# EAGLE schematic 090559_Sceptre (EAGLE 5.10)
AUTHOR: Elektor/CPV; DATASHEET: http://uk.farnell.com/multicomp/sdbmf-00915b0t2/card-sd-push-push/dp/9186174?Ntt=9186174; NRS: 090559-I; REV: 1.2

## Sheet 1 of 7
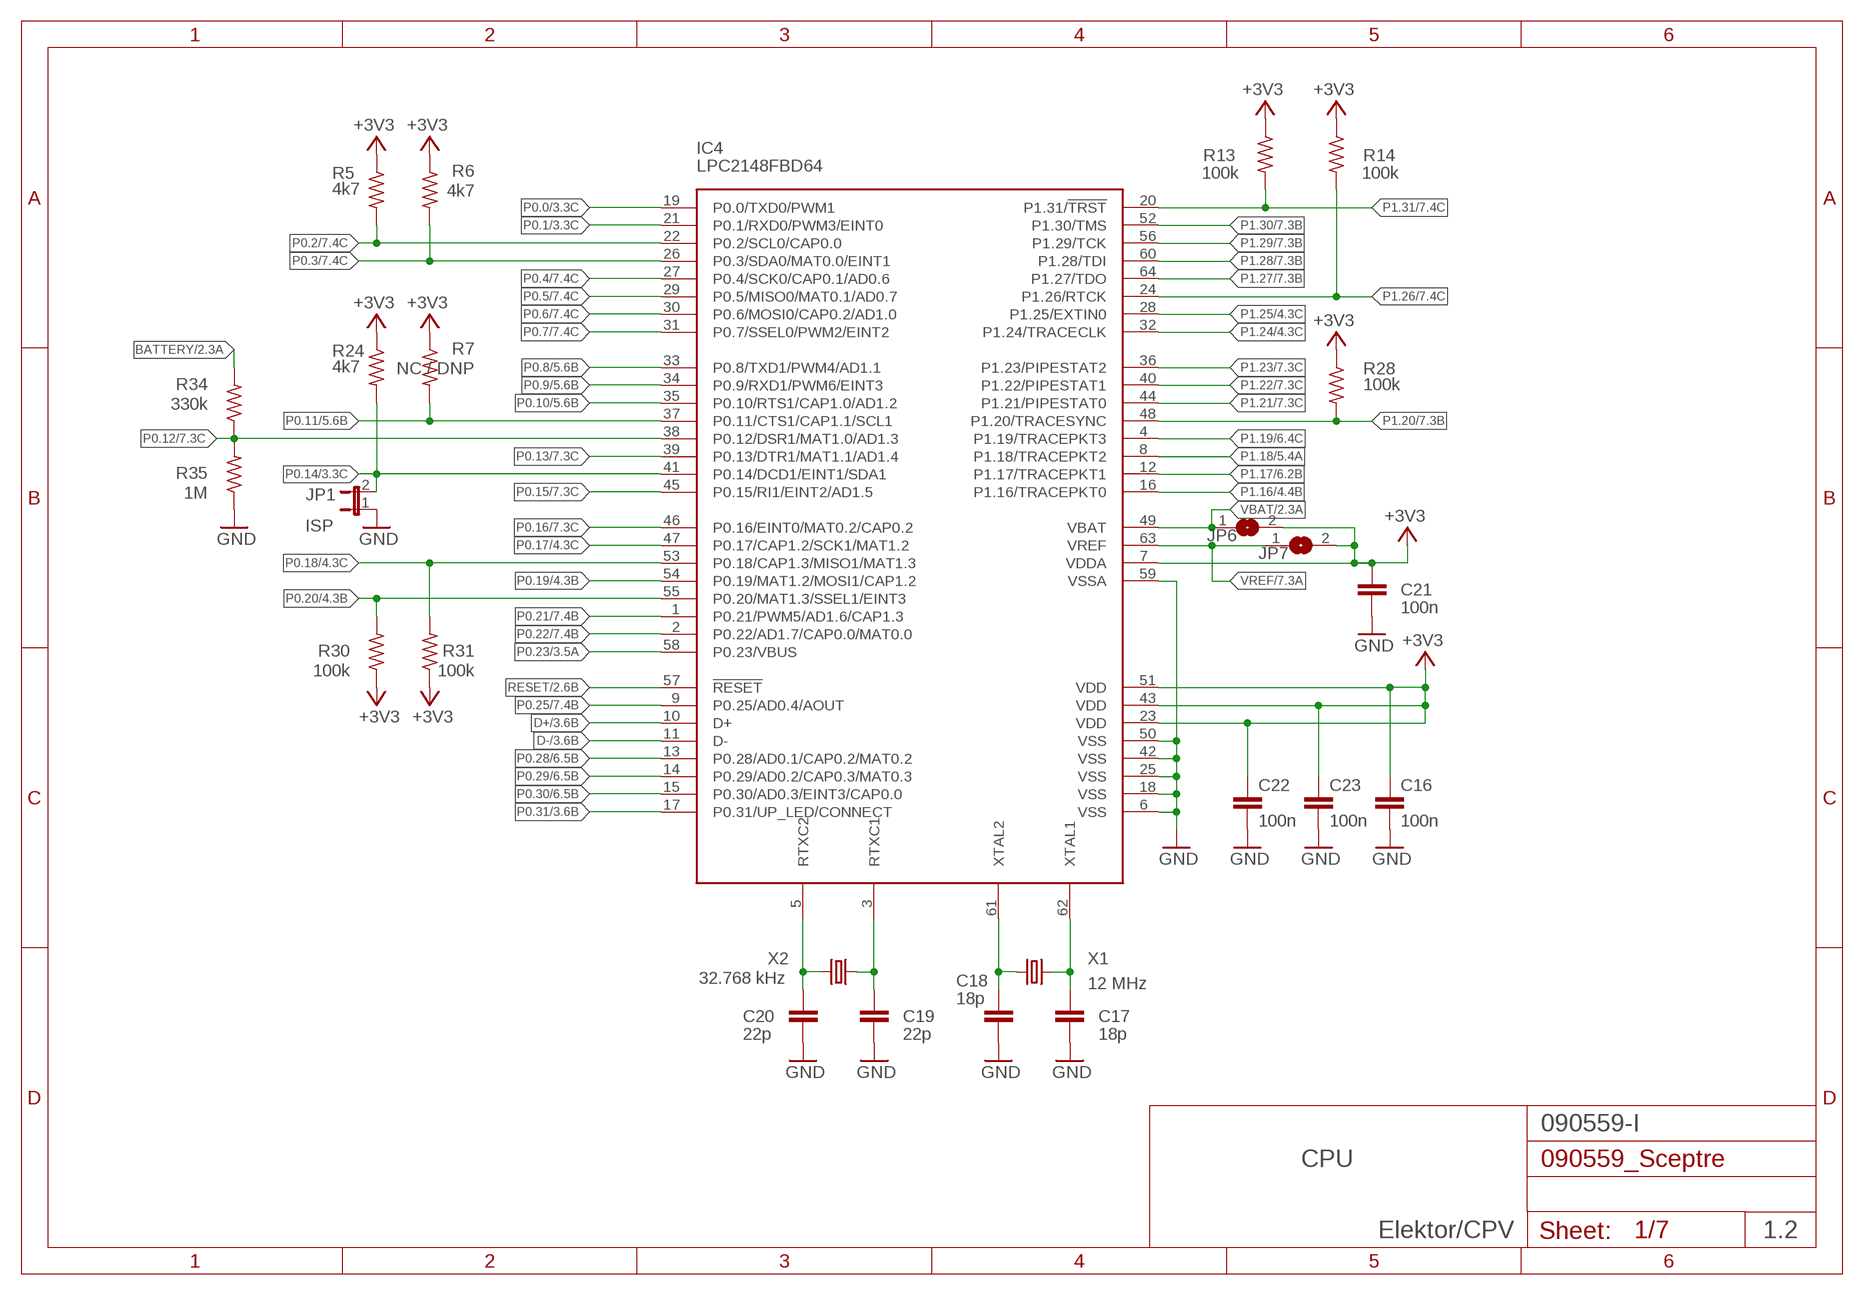
[diagram p0: schematic, sheet 1]

### Parts
C16  100n  C-EUC0805K  [C0805K]
C17  18p  C-EUC0805K  [C0805K]
C18  18p  C-EUC0805K  [C0805K]
C19  22p  C-EUC0805K  [C0805K]
C20  22p  C-EUC0805K  [C0805K]
C21  100n  C-EUC0805K  [C0805K]
C22  100n  C-EUC0805K  [C0805K]
C23  100n  C-EUC0805K  [C0805K]
IC4  LPC2148FBD64  [TSQFP50P1200X1200X160-64N]
JP1  ISP  JP1E  [JP1]
JP6  SJ  [SJ]
JP7  SJ  [SJ]
R5  4k7  R-US_R0805  [R0805]
R6  4k7  R-US_R0805  [R0805]
R7  NC / DNP  R-US_R0805  [R0805]
R13  100k  R-US_R0805  [R0805]
R14  100k  R-US_R0805  [R0805]
R24  4k7  R-US_R0805  [R0805]
R28  100k  R-US_R0603  [R0603]
R30  100k  R-US_R0603  [R0603]
R31  100k  R-US_R0603  [R0603]
R34  330k  R-US_R0805  [R0805]
R35  1M  R-US_R0805  [R0805]
X1  12 MHz  CRYSTALHC49UP  [HC49UP]
X2  32.768 kHz  CRYSTALWATCH_SMD  [WATCH_XTAL_1]

### Nets
+3V3: C16.1 C21.1 C22.1 C23.1 IC4.7(VDDA) IC4.23(VDD) IC4.43(VDD) IC4.51(VDD) JP6.2 JP7.2 R5.1 R6.1 R7.1 R13.1 R14.1 R24.1 R28.1 R30.1 R31.1 ; also sheet 2,3,4,5,6,7
BATTERY: R34.2 ; also sheet 2
D+: IC4.10(D+) ; also sheet 3
D-: IC4.11(D-) ; also sheet 3
GND: C16.2 C17.2 C18.2 C19.2 C20.2 C21.2 C22.2 C23.2 IC4.6(VSS) IC4.18(VSS) IC4.25(VSS) IC4.42(VSS) IC4.50(VSS) IC4.59(VSSA) JP1.1 R35.1 ; also sheet 2,3,4,5,6,7
N$52: C18.1 IC4.61(XTAL2) X1.1
N$53: C17.1 IC4.62(XTAL1) X1.2
N$54: C20.1 IC4.5(RTXC2) X2.P$2
N$55: C19.1 IC4.3(RTXC1) X2.P$1
P0.0: IC4.19(P0.0/TXD0/PWM1) ; also sheet 3,7
P0.1: IC4.21(P0.1/RXD0/PWM3/EINT0) ; also sheet 3,7
P0.2: IC4.22(P0.2/SCL0/CAP0.0) R5.2 ; also sheet 7
P0.3: IC4.26(P0.3/SDA0/MAT0.0/EINT1) R6.2 ; also sheet 7
P0.4: IC4.27(P0.4/SCK0/CAP0.1/AD0.6) ; also sheet 7
P0.5: IC4.29(P0.5/MISO0/MAT0.1/AD0.7) ; also sheet 7
P0.6: IC4.30(P0.6/MOSI0/CAP0.2/AD1.0) ; also sheet 7
P0.7: IC4.31(P0.7/SSEL0/PWM2/EINT2) ; also sheet 7
P0.8: IC4.33(P0.8/TXD1/PWM4/AD1.1) ; also sheet 5,7
P0.9: IC4.34(P0.9/RXD1/PWM6/EINT3) ; also sheet 5,7
P0.10: IC4.35(P0.10/RTS1/CAP1.0/AD1.2) ; also sheet 5,7
P0.11: IC4.37(P0.11/CTS1/CAP1.1/SCL1) R7.2 ; also sheet 5,7
P0.12: IC4.38(P0.12/DSR1/MAT1.0/AD1.3) R34.1 R35.2 ; also sheet 7
P0.13: IC4.39(P0.13/DTR1/MAT1.1/AD1.4) ; also sheet 7
P0.14: IC4.41(P0.14/DCD1/EINT1/SDA1) JP1.2 R24.2 ; also sheet 3,7
P0.15: IC4.45(P0.15/RI1/EINT2/AD1.5) ; also sheet 7
P0.16: IC4.46(P0.16/EINT0/MAT0.2/CAP0.2) ; also sheet 7
P0.17: IC4.47(P0.17/CAP1.2/SCK1/MAT1.2) ; also sheet 4,7
P0.18: IC4.53(P0.18/CAP1.3/MISO1/MAT1.3) R31.2 ; also sheet 4,7
P0.19: IC4.54(P0.19/MAT1.2/MOSI1/CAP1.2) ; also sheet 4,7
P0.20: IC4.55(P0.20/MAT1.3/SSEL1/EINT3) R30.2 ; also sheet 4,7
P0.21: IC4.1(P0.21/PWM5/AD1.6/CAP1.3) ; also sheet 7
P0.22: IC4.2(P0.22/AD1.7/CAP0.0/MAT0.0) ; also sheet 7
P0.23: IC4.58(P0.23/VBUS) ; also sheet 3,7
P0.25: IC4.9(P0.25/AD0.4/AOUT) ; also sheet 7
P0.28: IC4.13(P0.28/AD0.1/CAP0.2/MAT0.2) ; also sheet 6,7
P0.29: IC4.14(P0.29/AD0.2/CAP0.3/MAT0.3) ; also sheet 6,7
P0.30: IC4.15(P0.30/AD0.3/EINT3/CAP0.0) ; also sheet 6,7
P0.31: IC4.17(P0.31/UP_LED/CONNECT) ; also sheet 3,7
P1.16: IC4.16(P1.16/TRACEPKT0) ; also sheet 4,7
P1.17: IC4.12(P1.17/TRACEPKT1) ; also sheet 6,7
P1.18: IC4.8(P1.18/TRACEPKT2) ; also sheet 5,7
P1.19: IC4.4(P1.19/TRACEPKT3) ; also sheet 6,7
P1.20: IC4.48(P1.20/TRACESYNC) R28.2 ; also sheet 7
P1.21: IC4.44(P1.21/PIPESTAT0) ; also sheet 7
P1.22: IC4.40(P1.22/PIPESTAT1) ; also sheet 7
P1.23: IC4.36(P1.23/PIPESTAT2) ; also sheet 7
P1.24: IC4.32(P1.24/TRACECLK) ; also sheet 4,7
P1.25: IC4.28(P1.25/EXTIN0) ; also sheet 4,7
P1.26: IC4.24(P1.26/RTCK) R14.2 ; also sheet 7
P1.27: IC4.64(P1.27/TDO) ; also sheet 7
P1.28: IC4.60(P1.28/TDI) ; also sheet 7
P1.29: IC4.56(P1.29/TCK) ; also sheet 7
P1.30: IC4.52(P1.30/TMS) ; also sheet 7
P1.31: IC4.20(P1.31/!TRST) R13.2 ; also sheet 7
RESET: IC4.57(!RESET) ; also sheet 2,3,7
VBAT: IC4.49(VBAT) JP6.1 ; also sheet 2
VREF: IC4.63(VREF) JP7.1 ; also sheet 7

### Notes on the sheet
- CPU

## Sheet 2 of 7
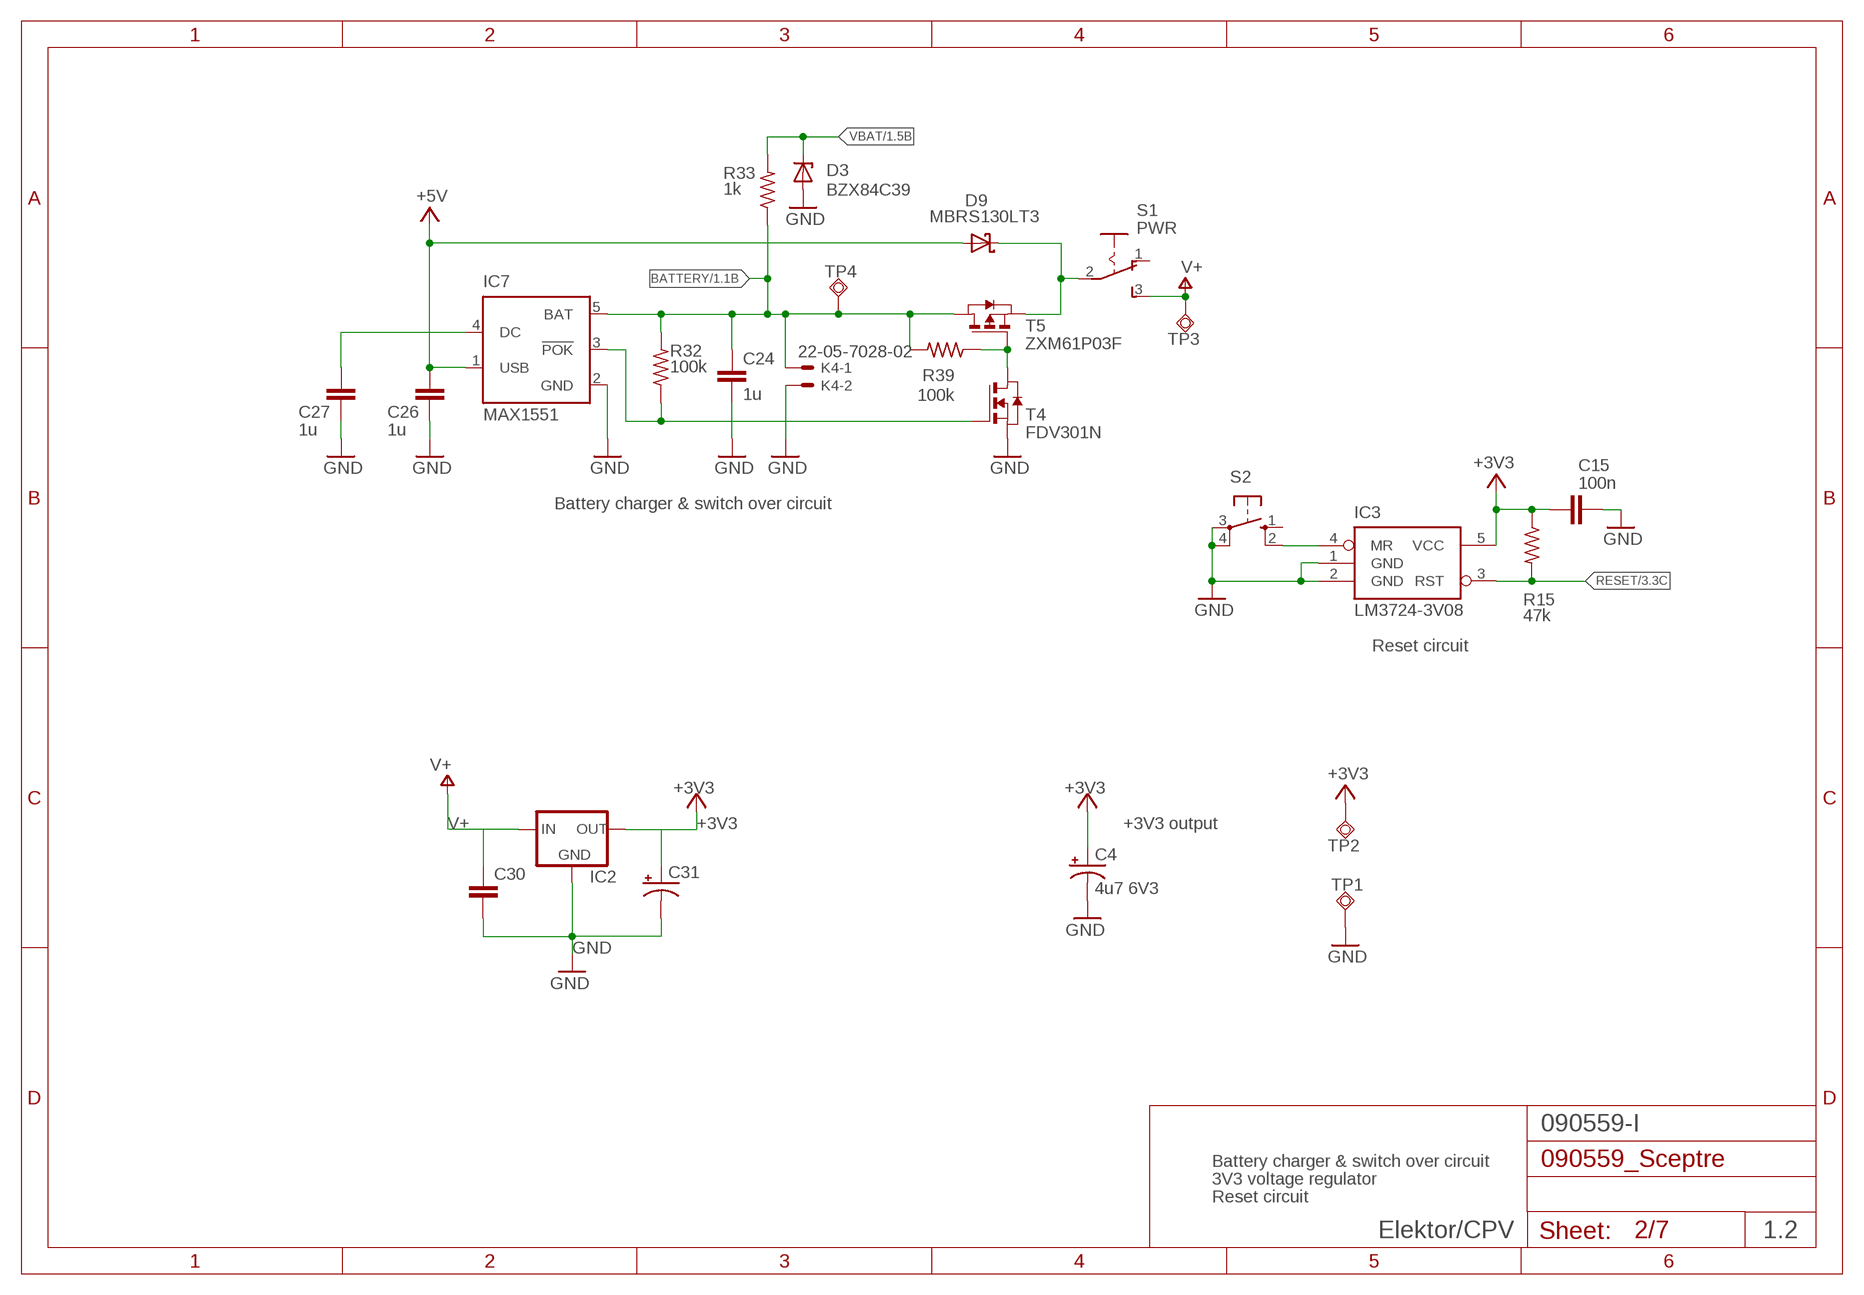
[diagram p1: schematic, sheet 2]

### Parts
C4  4u7 6V3  CPOL-US153CLV-0405  [153CLV-0405]
C15  100n  C-EUC0805K  [C0805K]
C24  1u  C-EUC0805  [C0805]
C26  1u  C-EUC0805  [C0805]
C27  1u  C-EUC0805  [C0805]
C30  CAP0805  [0805]
C31  CAP_POL1206  [EIA3216]
D3  BZX84C39  ZENER-DIODESOT23  [SOT23]
D9  MBRS130LT3  [SMB]
IC2  LM1117  [SOT223]
IC3  LM3724-3V08  LM3724  [SOT23-5L]
IC7  MAX1551  [SOT23-5L]
K4  22-05-7028-02  [7395-02]
R15  47k  R-US_R0603  [R0603]
R32  100k  R-US_M0805  [M0805]
R33  1k  R-US_M0805  [M0805]
R39  100k  R-US_M0805  [M0805]
S1  PWR  255SB  [255SB]
S2  10-XX  [B3F-10XX]
T4  FDV301N  NMOSSOT23  [SOT-23]
T5  ZXM61P03F  PMOSSOT23  [SOT-23]
TP1  TPSQPAD1-13  [P1-13]
TP2  TPSQPAD1-13  [P1-13]
TP3  TPSQB1,27  [B1,27]
TP4  TPSQB1,27  [B1,27]

### Nets
+3V3: C4.+ C15.2 C31.A(+) IC2.2(OUT) IC3.5(VCC) R15.1 TP2.TP ; also sheet 1,3,4,5,6,7
+5V: C26.1 D9.A IC7.1(USB) ; also sheet 3,7
/POK: IC7.3(!POK) R32.1 T4.3(G)
BATTERY: C24.1 IC7.5(BAT) K4.1 R32.2 R33.1 R39.2 T5.1(D) TP4.TP ; also sheet 1
GND: C4.- C15.1 C24.2 C26.2 C27.2 C30.2 C31.C(-) D3.1(A) IC2.1(GND) IC3.1(GND) IC3.2(GND) IC7.2(GND) K4.2 S2.3(P) S2.4(P1) T4.2(S) TP1.TP ; also sheet 1,3,4,5,6,7
N$7: R39.1 T4.1(D) T5.3(G)
N$8: C27.1 IC7.4(DC)
N$24: D9.C S1.2(P) T5.2(S)
N$47: IC3.4(MR) S2.2(S1)
RESET: IC3.3(RST) R15.2 ; also sheet 1,3,7
V+: C30.1 IC2.3(IN) S1.3(S) TP3.TP
VBAT: D3.3(C) R33.2 ; also sheet 1
Unconnected: S1.1(O) S2.1(S)

### Notes on the sheet
- Battery charger & switch over circuit
- Reset circuit
- +3V3 output
- Battery charger & switch over circuit
- 3V3 voltage regulator
- Reset circuit

## Sheet 3 of 7
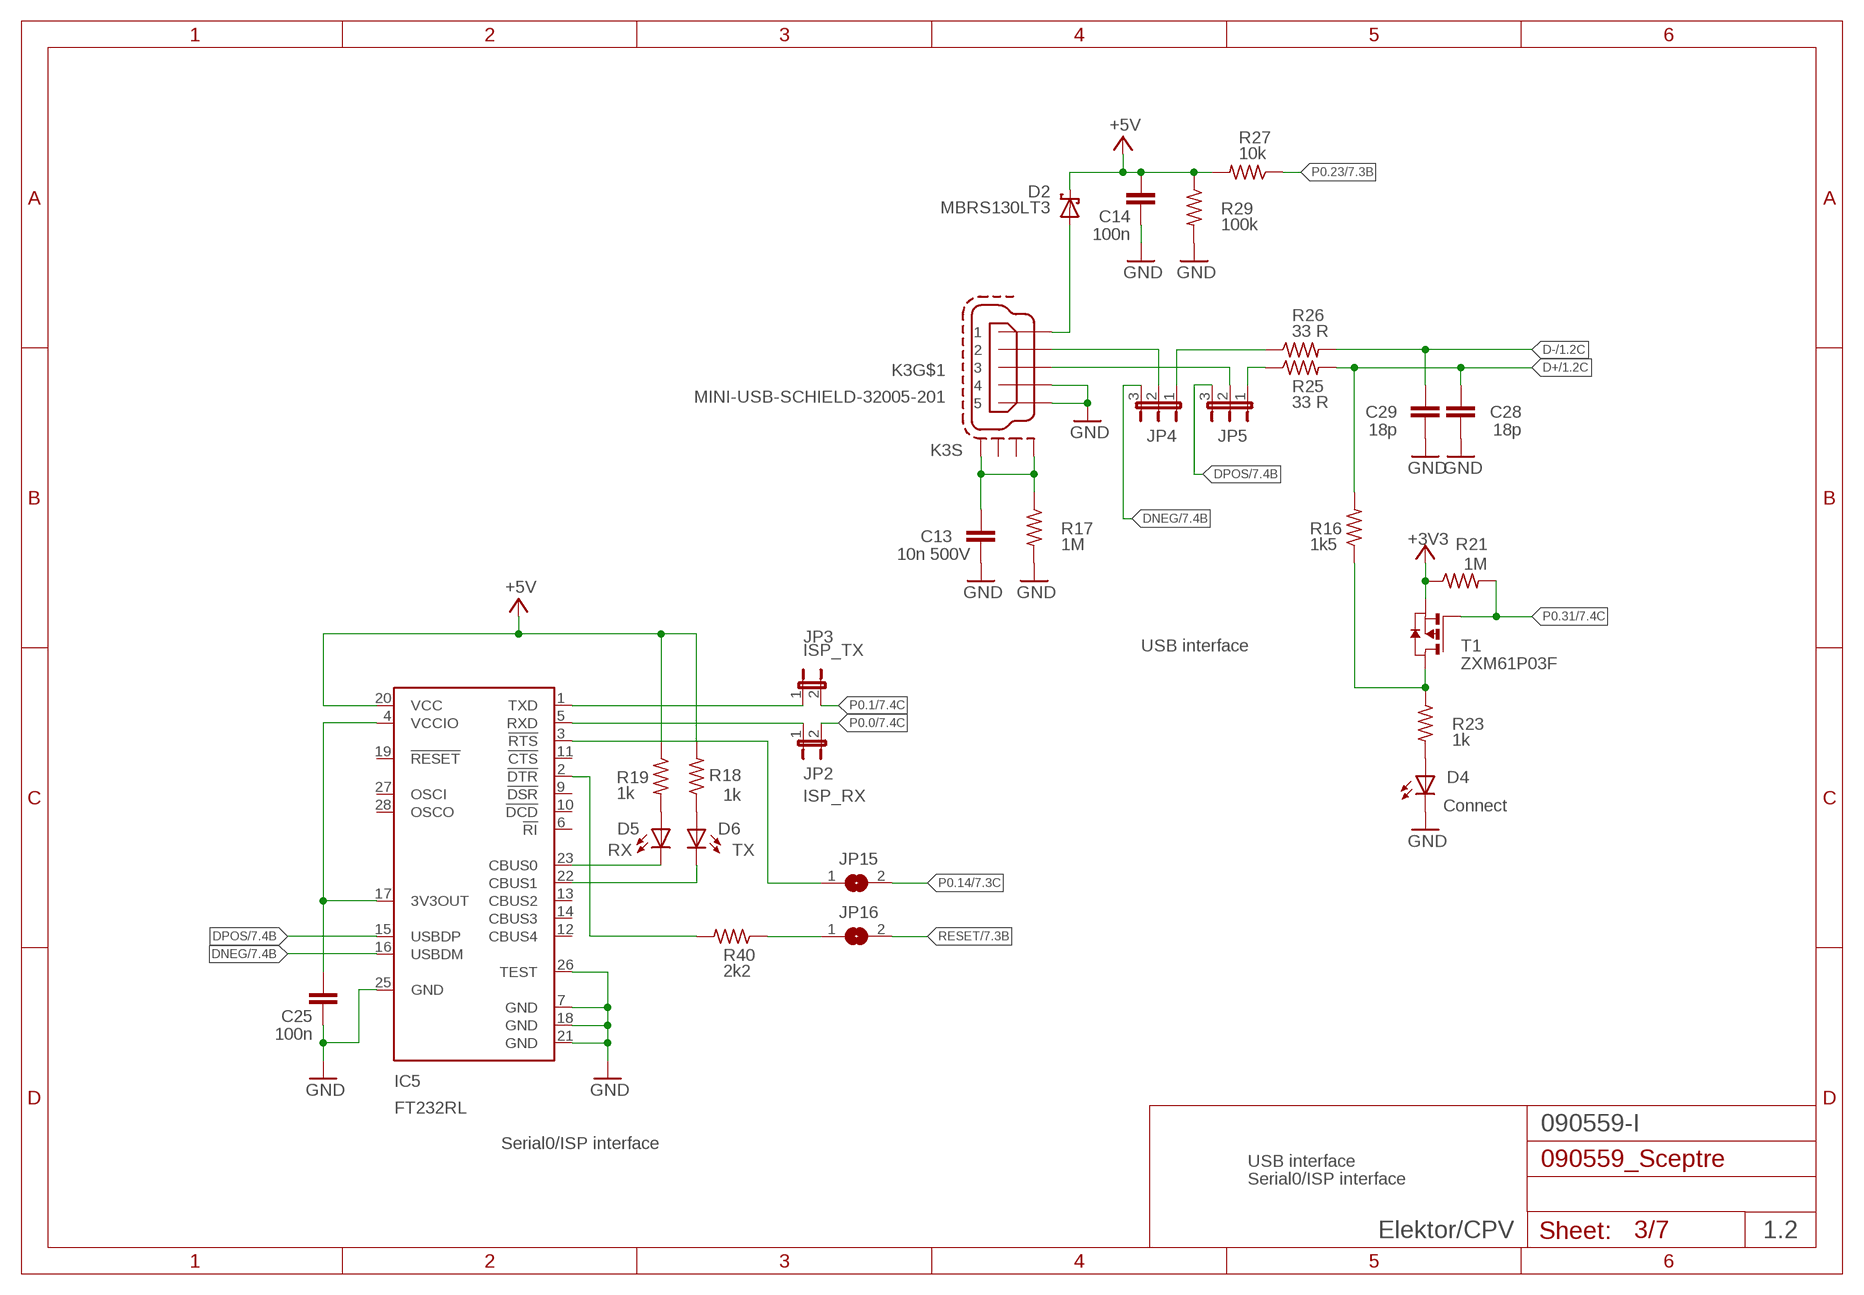
[diagram p2: schematic, sheet 3]

### Parts
C13  10n 500V  C-EUC1206  [C1206]
C14  100n  C-EUC0805K  [C0805K]
C25  100n  C-EUC0805K  [C0805K]
C28  18p  C-EUC0805K  [C0805K]
C29  18p  C-EUC0805K  [C0805K]
D2  MBRS130LT3  [SMB]
D4  LEDCHIPLED_0805  [CHIPLED_0805]
D5  LEDCHIPLED_0805  [CHIPLED_0805]
D6  LEDCHIPLED_0805  [CHIPLED_0805]
IC5  FT232RL  [SSOP28]
JP2  ISP_RX  JP1E  [JP1]
JP3  ISP_TX  JP1E  [JP1]
JP4  JP2E  [JP2]
JP5  JP2E  [JP2]
JP15  SJ  [SJ]
JP16  SJ  [SJ]
K3  MINI-USB-SCHIELD-32005-201  [32005-201]
R16  1k5  R-US_R0805  [R0805]
R17  1M  R-US_R0603  [R0603]
R18  1k  R-US_R0805  [R0805]
R19  1k  R-US_R0805  [R0805]
R21  1M  R-US_R0805  [R0805]
R23  1k  R-US_R0805  [R0805]
R25  33 R  R-US_R0603  [R0603]
R26  33 R  R-US_R0603  [R0603]
R27  10k  R-US_R0603  [R0603]
R29  100k  R-US_R0603  [R0603]
R40  2k2  R-US_R0603  [R0603]
T1  ZXM61P03F  PMOSSOT23  [SOT-23]

### Nets
+3V3: R21.1 T1.2(S) ; also sheet 1,2,4,5,6,7
+5V: C14.2 D2.C IC5.20(VCC) R18.2 R19.1 R27.2 R29.1 ; also sheet 2,7
D+: C28.1 R16.2 R25.2 ; also sheet 1
D-: C29.1 R26.2 ; also sheet 1
DNEG: IC5.16(USBDM) JP4.3 ; also sheet 7
DPOS: IC5.15(USBDP) JP5.3 ; also sheet 7
GND: C13.2 C14.1 C25.1 C28.2 C29.2 D4.C IC5.7(GND) IC5.18(GND) IC5.21(GND) IC5.25(GND) IC5.26(TEST) K3.4 K3.5 R17.2 R29.2 ; also sheet 1,2,4,5,6,7
N$2: C13.1 K3.M1(S:S1) K3.M4(S:S4) R17.1
N$9: JP5.1 R25.1
N$10: JP4.1 R26.1
N$11: R16.1 R23.1 T1.1(D)
N$14: JP4.2 K3.2
N$15: JP5.2 K3.3
N$17: D4.A R23.2
N$18: IC5.3(!RTS) JP15.1
N$19: IC5.5(RXD) JP2.1
N$20: IC5.1(TXD) JP3.1
N$21: IC5.2(!DTR) R40.2
N$25: JP16.1 R40.1
N$35: C25.2 IC5.4(VCCIO) IC5.17(3V3OUT)
N$39: D5.C IC5.23(CBUS0)
N$40: D6.C IC5.22(CBUS1)
N$41: D6.A R18.1
N$42: D5.A R19.2
N$48: D2.A K3.1
P0.0: JP2.2 ; also sheet 1,7
P0.1: JP3.2 ; also sheet 1,7
P0.14: JP15.2 ; also sheet 1,7
P0.23: R27.1 ; also sheet 1,7
P0.31: R21.2 T1.3(G) ; also sheet 1,7
RESET: JP16.2 ; also sheet 1,2,7
Unconnected: IC5.6(!RI) IC5.9(!DSR) IC5.10(!DCD) IC5.11(!CTS) IC5.12(CBUS4) IC5.13(CBUS2) IC5.14(CBUS3) IC5.19(!RESET) IC5.27(OSCI) IC5.28(OSCO) K3.M2(S:S2) K3.M3(S:S3)

### Notes on the sheet
- USB interface
- Connect
- RX | TX
- Serial0/ISP interface
- USB interface
- Serial0/ISP interface

## Sheet 4 of 7
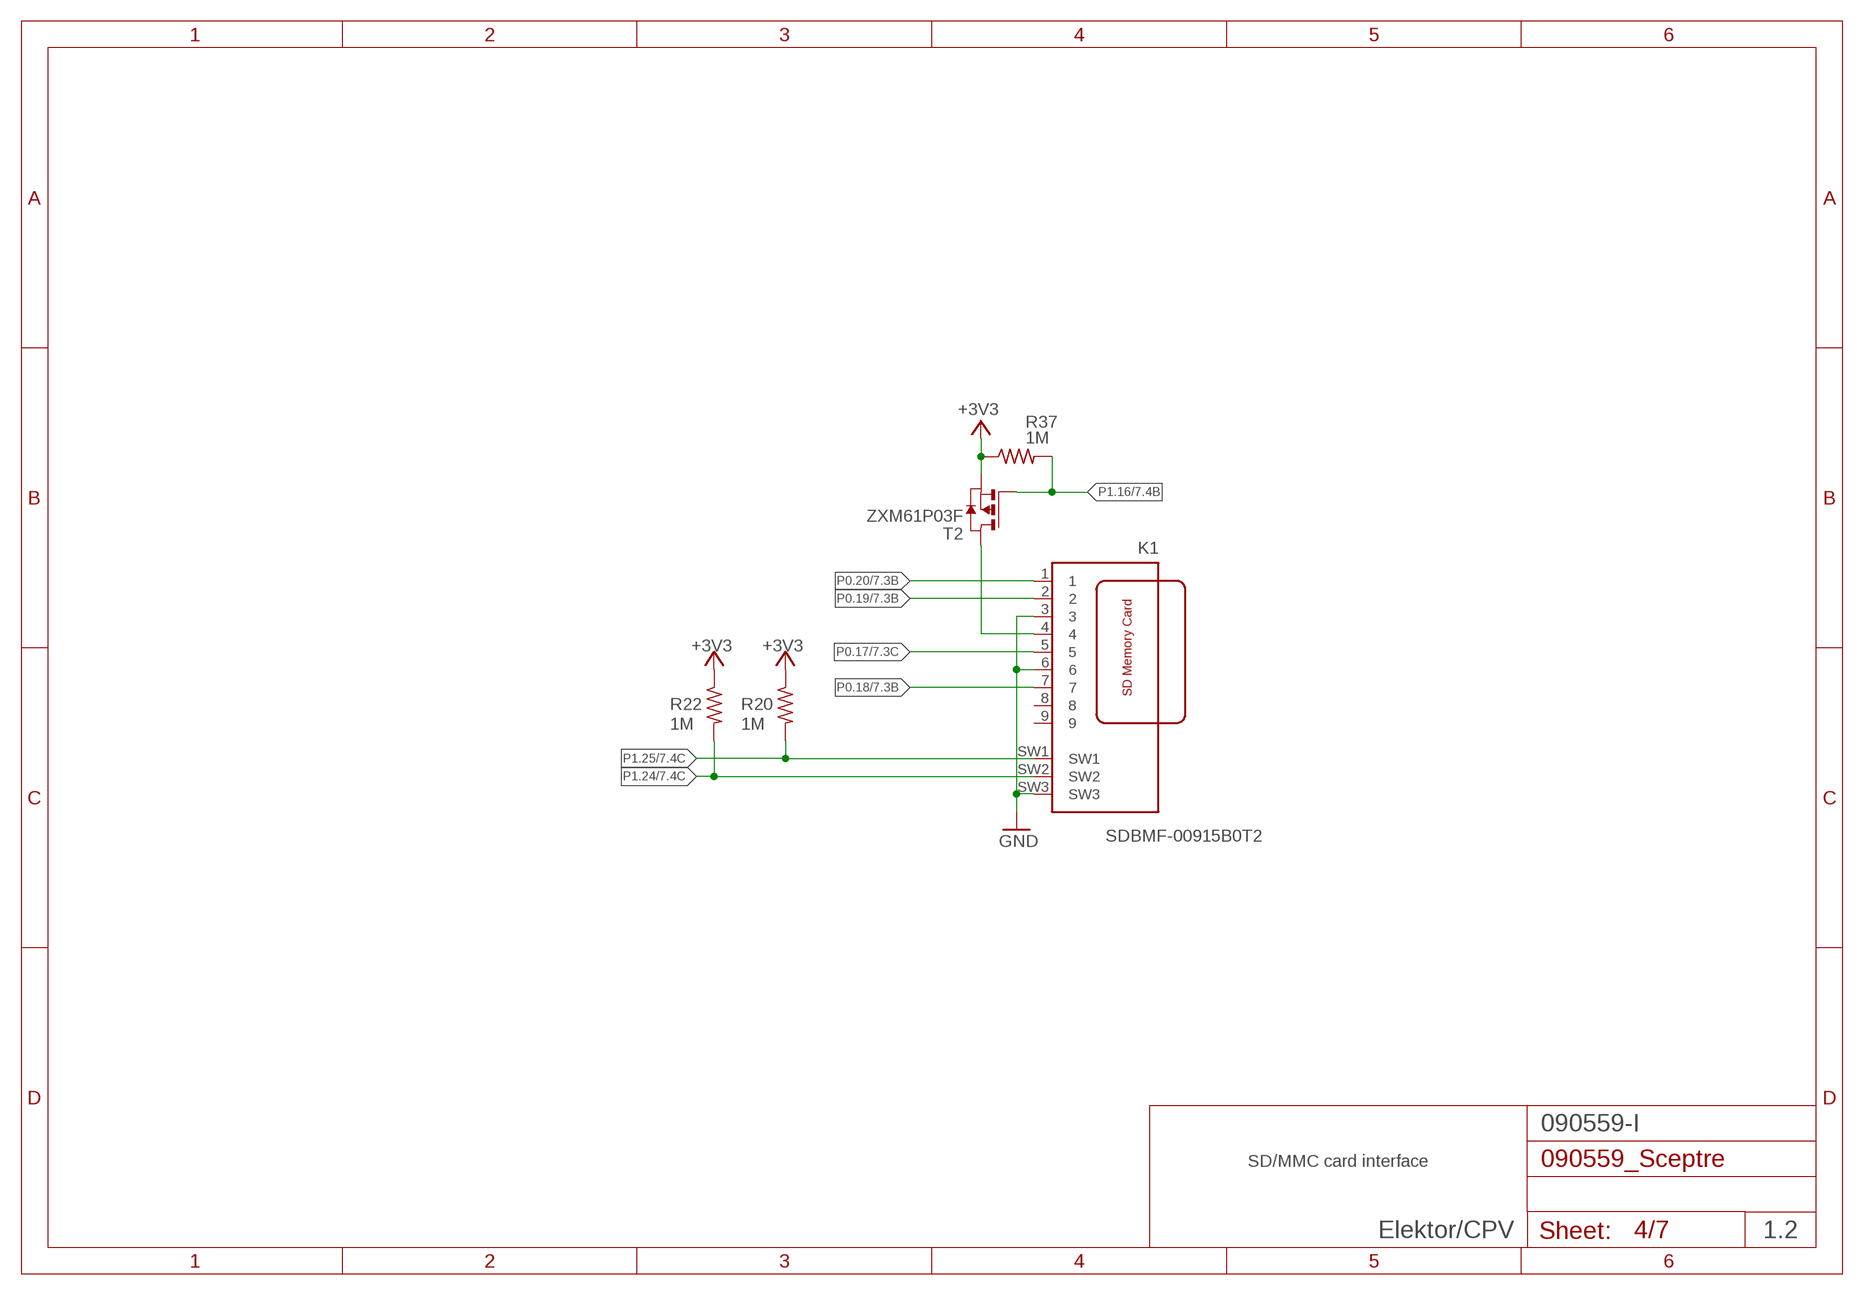
[diagram p3: schematic, sheet 4]

### Parts
K1  SDBMF-00915B0T2  SDBMF  [SDBMF-009XXBXX2]
R20  1M  R-US_R0603  [R0603]
R22  1M  R-US_R0805  [R0805]
R37  1M  R-US_R0603  [R0603]
T2  ZXM61P03F  PMOSSOT23  [SOT-23]

### Nets
+3V3: R20.1 R22.1 R37.1 T2.2(S) ; also sheet 1,2,3,5,6,7
GND: K1.3 K1.6 K1.SW3 ; also sheet 1,2,3,5,6,7
N$22: K1.4 T2.1(D)
P0.17: K1.5 ; also sheet 1,7
P0.18: K1.7 ; also sheet 1,7
P0.19: K1.2 ; also sheet 1,7
P0.20: K1.1 ; also sheet 1,7
P1.16: R37.2 T2.3(G) ; also sheet 1,7
P1.24: K1.SW2 R22.2 ; also sheet 1,7
P1.25: K1.SW1 R20.2 ; also sheet 1,7
Unconnected: K1.8 K1.9

### Notes on the sheet
- SD/MMC card interface

## Sheet 5 of 7
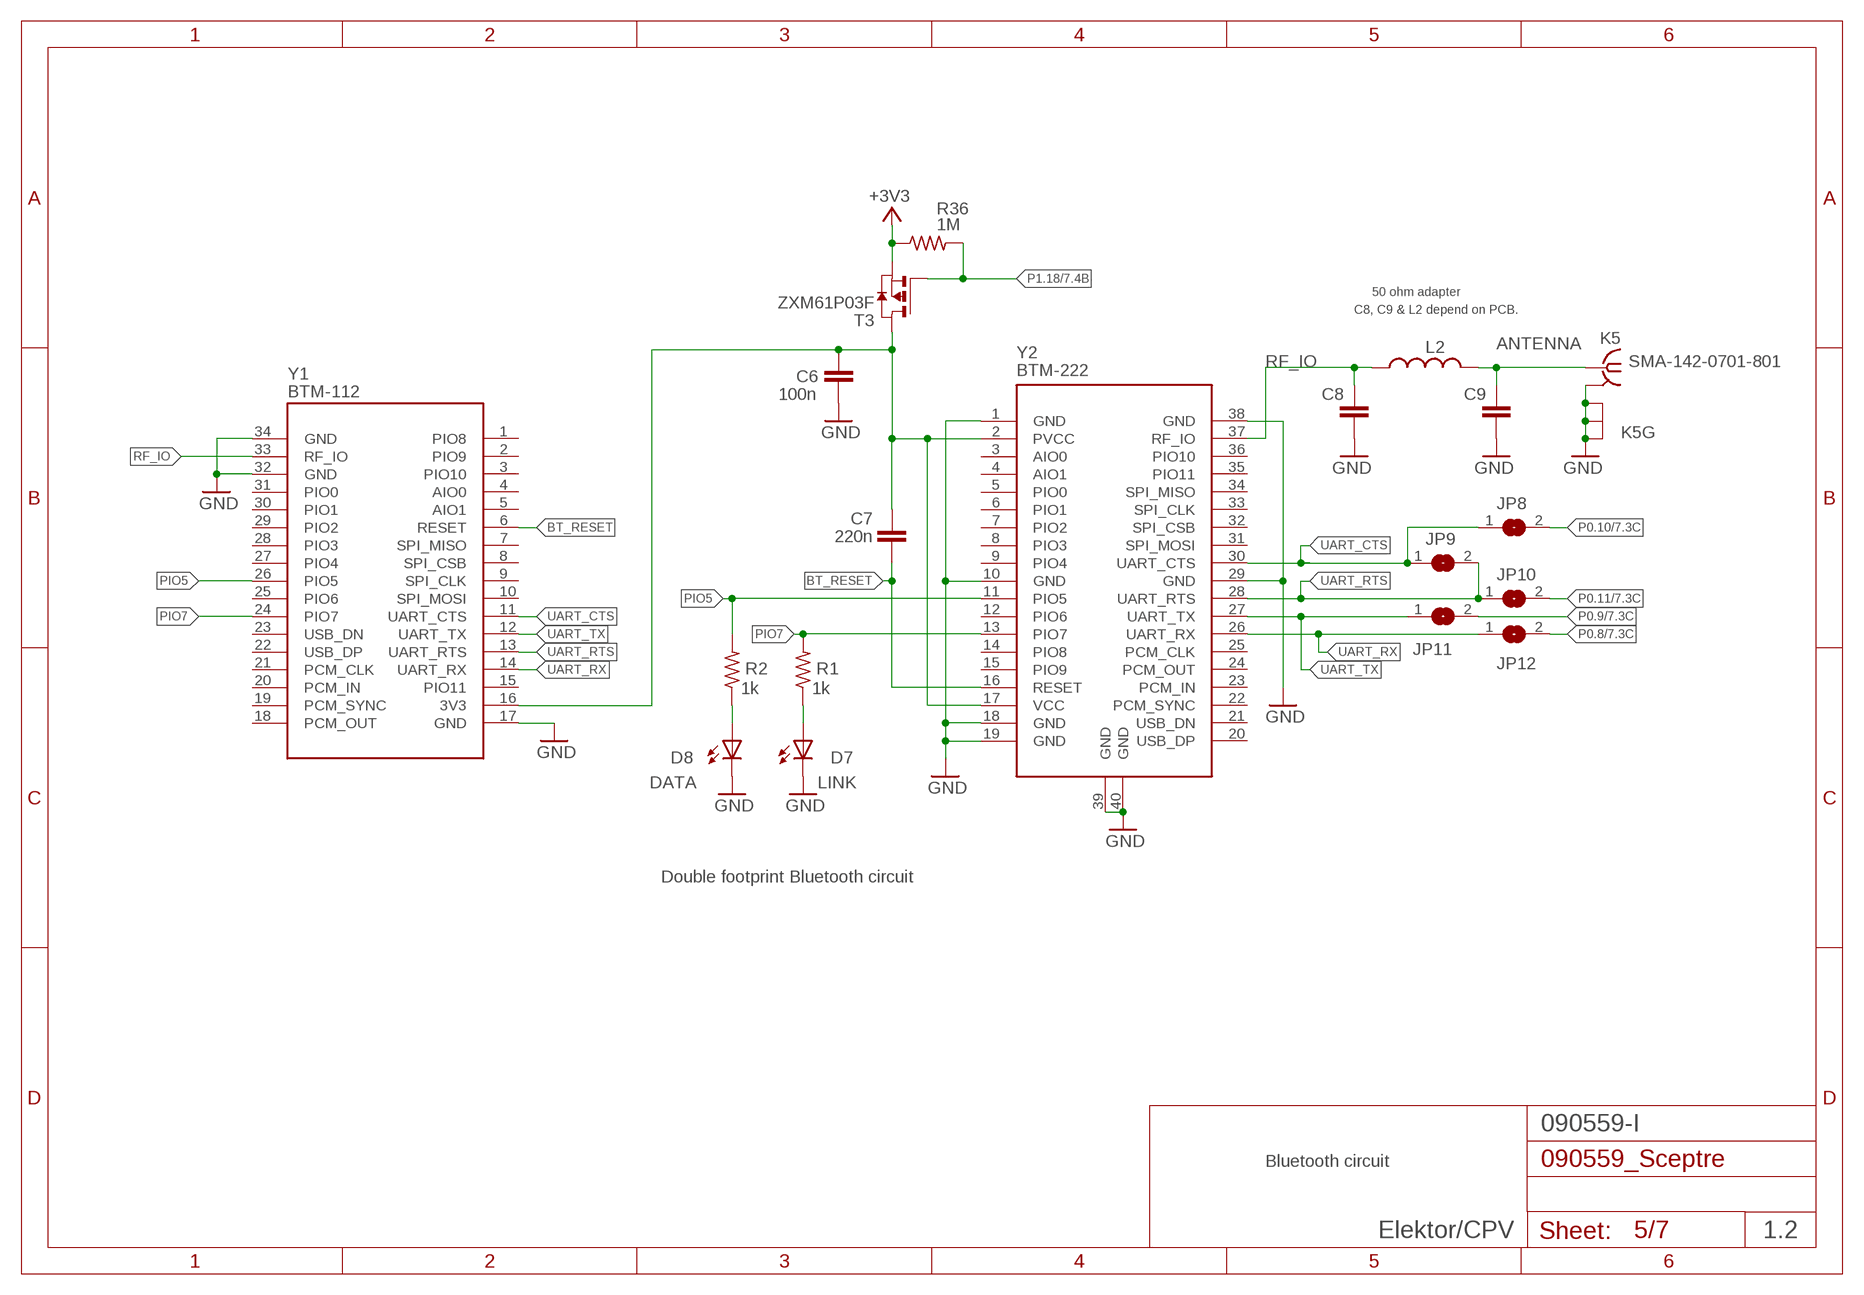
[diagram p4: schematic, sheet 5]

### Parts
C6  100n  C-EUC0805K  [C0805K]
C7  220n  C-EUC0805K  [C0805K]
C8  C-EUC0805K  [C0805K]
C9  C-EUC0805K  [C0805K]
D7  LEDCHIPLED_0805  [CHIPLED_0805]
D8  LEDCHIPLED_0805  [CHIPLED_0805]
JP8  SJ  [SJ]
JP9  SJ  [SJ]
JP10  SJ  [SJ]
JP11  SJ  [SJ]
JP12  SJ  [SJ]
K5  SMA-142-0701-801  SMA-142-0701-871/876  [J502-ND-142-0701-871/876]
L2  L-USL2012C  [L2012C]
R1  1k  R-US_R0603  [R0603]
R2  1k  R-US_R0603  [R0603]
R36  1M  R-US_R0805  [R0805]
T3  ZXM61P03F  PMOSSOT23  [SOT-23]
Y1  BTM-112  [BTM-112]
Y2  BTM-222  [BTM-22X]

### Nets
+3V3: R36.1 T3.2(S) ; also sheet 1,2,3,4,6,7
ANTENNA: C9.1 K5.1 L2.1
BT_RESET: C7.1 Y1.6(RESET) Y2.16(RESET)
GND: C6.1 C8.2 C9.2 D7.C D8.C K5.G@1(GND) K5.G@2(GND) K5.G@3(GND) K5.G@4(GND) Y1.17(GND) Y1.32(GND) Y1.34(GND) Y2.1(GND) Y2.10(GND) Y2.18(GND) Y2.19(GND) Y2.29(GND) Y2.38(GND) Y2.39(GND) Y2.40(GND) ; also sheet 1,2,3,4,6,7
N$12: D7.A R1.1
N$13: D8.A R2.1
N$23: C6.2 C7.2 T3.1(D) Y1.16(3V3) Y2.2(PVCC) Y2.17(VCC)
P0.8: JP12.2 ; also sheet 1,7
P0.9: JP11.2 ; also sheet 1,7
P0.10: JP8.2 ; also sheet 1,7
P0.11: JP10.2 ; also sheet 1,7
P1.18: R36.2 T3.3(G) ; also sheet 1,7
PIO5: R2.2 Y1.26(PIO5) Y2.11(PIO5)
PIO7: R1.2 Y1.24(PIO7) Y2.13(PIO7)
RF_IO: C8.1 L2.2 Y1.33(RF_IO) Y2.37(RF_IO)
UART_CTS: JP8.1 JP9.1 Y1.11(UART_CTS) Y2.30(UART_CTS)
UART_RTS: JP9.2 JP10.1 Y1.13(UART_RTS) Y2.28(UART_RTS)
UART_RX: JP12.1 Y1.14(UART_RX) Y2.26(UART_RX)
UART_TX: JP11.1 Y1.12(UART_TX) Y2.27(UART_TX)
Unconnected: Y1.1(PIO8) Y1.2(PIO9) Y1.3(PIO10) Y1.4(AIO0) Y1.5(AIO1) Y1.7(SPI_MISO) Y1.8(SPI_CSB) Y1.9(SPI_CLK) Y1.10(SPI_MOSI) Y1.15(PIO11) Y1.18(PCM_OUT) Y1.19(PCM_SYNC) Y1.20(PCM_IN) Y1.21(PCM_CLK) Y1.22(USB_DP) Y1.23(USB_DN) Y1.25(PIO6) Y1.27(PIO4) Y1.28(PIO3) Y1.29(PIO2) Y1.30(PIO1) Y1.31(PIO0) Y2.3(AIO0) Y2.4(AIO1) Y2.5(PIO0) Y2.6(PIO1) Y2.7(PIO2) Y2.8(PIO3) Y2.9(PIO4) Y2.12(PIO6) Y2.14(PIO8) Y2.15(PIO9) Y2.20(USB_DP) Y2.21(USB_DN) Y2.22(PCM_SYNC) Y2.23(PCM_IN) Y2.24(PCM_OUT) Y2.25(PCM_CLK) Y2.31(SPI_MOSI) Y2.32(SPI_CSB) Y2.33(SPI_CLK) Y2.34(SPI_MISO) Y2.35(PIO11) Y2.36(PIO10)

### Notes on the sheet
- 50 ohm adapter
- C8, C9 & L2 depend on PCB.
- DATA | LINK
- Double footprint Bluetooth circuit
- Bluetooth circuit

## Sheet 6 of 7
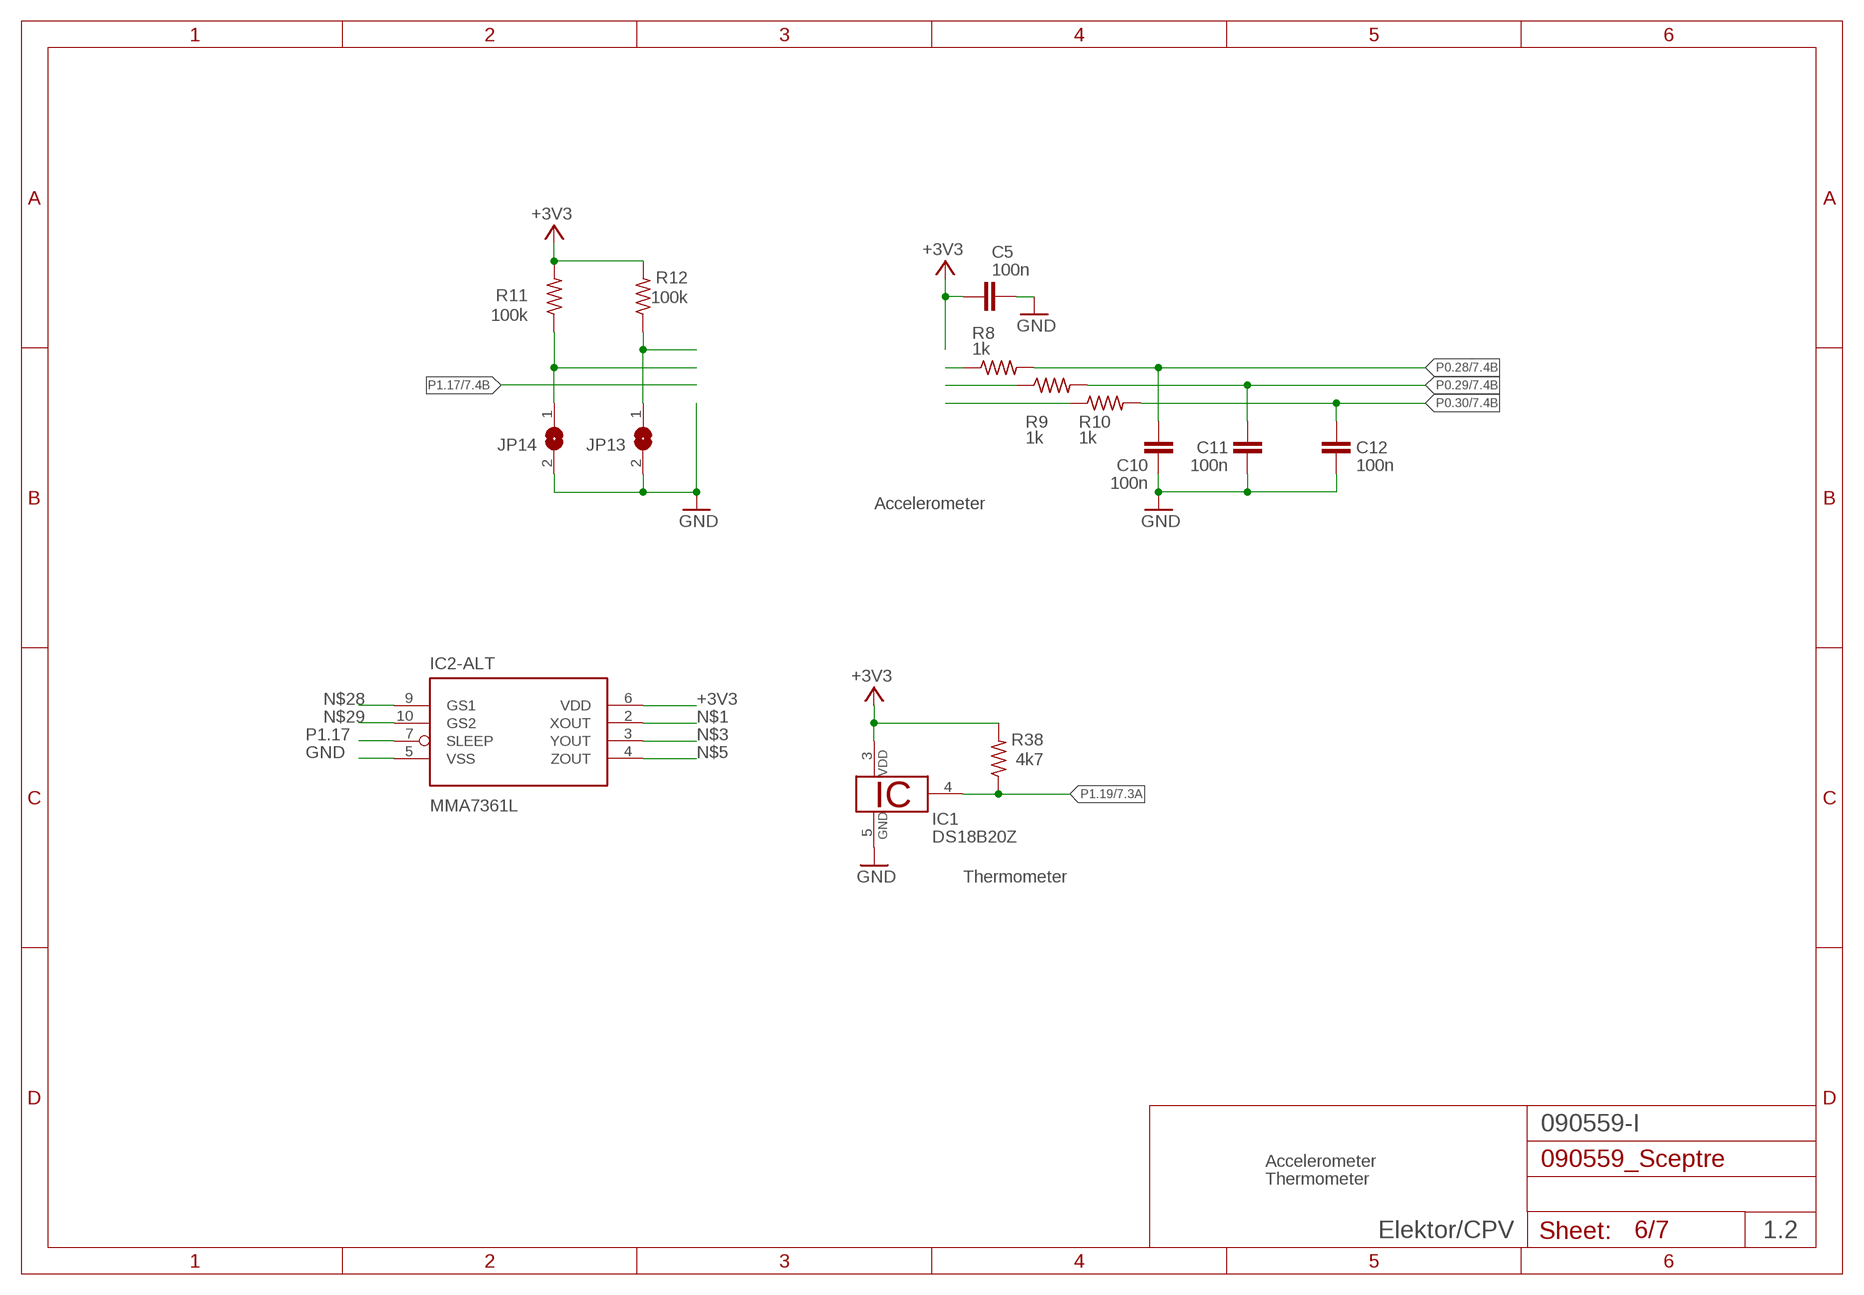
[diagram p5: schematic, sheet 6]

### Parts
C5  100n  C-EUC0805K  [C0805K]
C10  100n  C-EUC0805K  [C0805K]
C11  100n  C-EUC0805K  [C0805K]
C12  100n  C-EUC0805K  [C0805K]
IC1  DS18B20Z  DS18S20Z  [SO08]
IC2-ALT  MMA7361L  [LGA14]
JP13  SJ  [SJ]
JP14  SJ  [SJ]
R8  1k  R-US_R0805  [R0805]
R9  1k  R-US_R0603  [R0603]
R10  1k  R-US_R0603  [R0603]
R11  100k  R-US_R0603  [R0603]
R12  100k  R-US_R0603  [R0603]
R38  4k7  R-US_R0805  [R0805]

### Nets
+3V3: C5.1 IC1.3 IC2-ALT.6(VDD) R11.2 R12.2 R38.2 ; also sheet 1,2,3,4,5,7
GND: C5.2 C10.1 C11.1 C12.1 IC1.5 IC2-ALT.5(VSS) JP13.2 JP14.2 ; also sheet 1,2,3,4,5,7
N$1: IC2-ALT.2(XOUT) R8.1
N$3: IC2-ALT.3(YOUT) R9.1
N$5: IC2-ALT.4(ZOUT) R10.1
N$28: IC2-ALT.9(GS1) JP13.1 R12.1
N$29: IC2-ALT.10(GS2) JP14.1 R11.1
P0.28: C10.2 R8.2 ; also sheet 1,7
P0.29: C11.2 R9.2 ; also sheet 1,7
P0.30: C12.2 R10.2 ; also sheet 1,7
P1.17: IC2-ALT.7(SLEEP) ; also sheet 1,7
P1.19: IC1.4 R38.1 ; also sheet 1,7

### Notes on the sheet
- Accelerometer
- Thermometer
- Accelerometer
- Thermometer

## Sheet 7 of 7
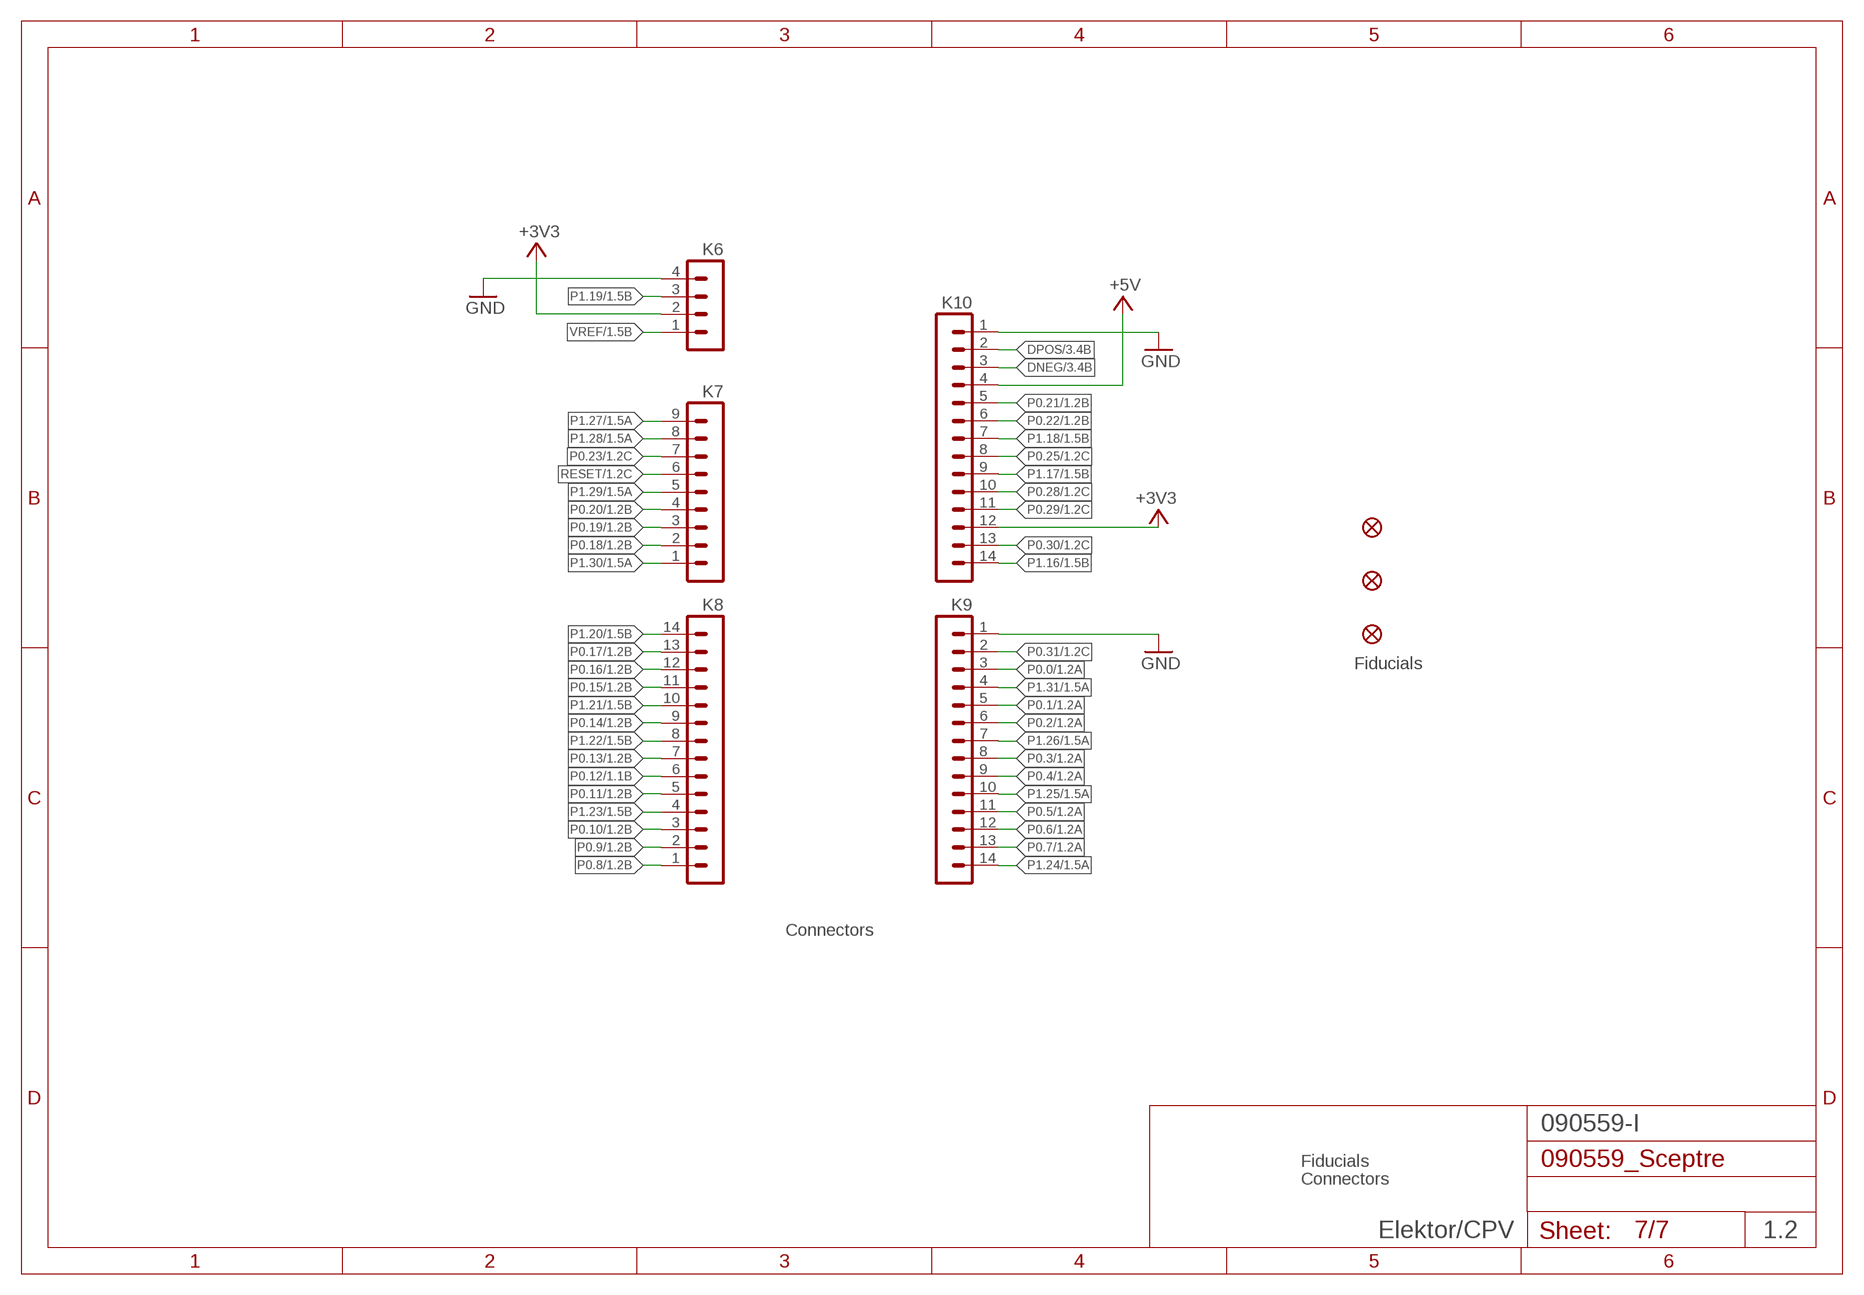
[diagram p6: schematic, sheet 7]

### Parts
K6  MA04-1  [MA04-1]
K7  MA09-1  [MA09-1]
K8  MA14-1  [MA14-1]
K9  MA14-1  [MA14-1]
K10  MA14-1  [MA14-1]
U$1  FIDUCIAL1.5X3  [FIDUCIAL-1.5X3]
U$2  FIDUCIAL1.5X3  [FIDUCIAL-1.5X3]
U$3  FIDUCIAL1.5X3  [FIDUCIAL-1.5X3]

### Nets
+3V3: K6.2 K10.12 ; also sheet 1,2,3,4,5,6
+5V: K10.4 ; also sheet 2,3
DNEG: K10.3 ; also sheet 3
DPOS: K10.2 ; also sheet 3
GND: K6.4 K9.1 K10.1 ; also sheet 1,2,3,4,5,6
P0.0: K9.3 ; also sheet 1,3
P0.1: K9.5 ; also sheet 1,3
P0.2: K9.6 ; also sheet 1
P0.3: K9.8 ; also sheet 1
P0.4: K9.9 ; also sheet 1
P0.5: K9.11 ; also sheet 1
P0.6: K9.12 ; also sheet 1
P0.7: K9.13 ; also sheet 1
P0.8: K8.1 ; also sheet 1,5
P0.9: K8.2 ; also sheet 1,5
P0.10: K8.3 ; also sheet 1,5
P0.11: K8.5 ; also sheet 1,5
P0.12: K8.6 ; also sheet 1
P0.13: K8.7 ; also sheet 1
P0.14: K8.9 ; also sheet 1,3
P0.15: K8.11 ; also sheet 1
P0.16: K8.12 ; also sheet 1
P0.17: K8.13 ; also sheet 1,4
P0.18: K7.2 ; also sheet 1,4
P0.19: K7.3 ; also sheet 1,4
P0.20: K7.4 ; also sheet 1,4
P0.21: K10.5 ; also sheet 1
P0.22: K10.6 ; also sheet 1
P0.23: K7.7 ; also sheet 1,3
P0.25: K10.8 ; also sheet 1
P0.28: K10.10 ; also sheet 1,6
P0.29: K10.11 ; also sheet 1,6
P0.30: K10.13 ; also sheet 1,6
P0.31: K9.2 ; also sheet 1,3
P1.16: K10.14 ; also sheet 1,4
P1.17: K10.9 ; also sheet 1,6
P1.18: K10.7 ; also sheet 1,5
P1.19: K6.3 ; also sheet 1,6
P1.20: K8.14 ; also sheet 1
P1.21: K8.10 ; also sheet 1
P1.22: K8.8 ; also sheet 1
P1.23: K8.4 ; also sheet 1
P1.24: K9.14 ; also sheet 1,4
P1.25: K9.10 ; also sheet 1,4
P1.26: K9.7 ; also sheet 1
P1.27: K7.9 ; also sheet 1
P1.28: K7.8 ; also sheet 1
P1.29: K7.5 ; also sheet 1
P1.30: K7.1 ; also sheet 1
P1.31: K9.4 ; also sheet 1
RESET: K7.6 ; also sheet 1,2,3
VREF: K6.1 ; also sheet 1

### Notes on the sheet
- Fiducials
- Connectors
- Fiducials
- Connectors

## Library data of the parts
C4 = resistor:CPOL-US: POLARIZED CAPACITOR, American symbol
C5-C29 = resistor:C-EU: CAPACITOR, European symbol
C30 = SparkFun:CAP: Capacitor Standard 0603 ceramic capacitor, and 0.1" leaded capacitor.
C31 = SparkFun:CAP_POL: Capacitor Polarized These are standard SMD and PTH capacitors. Normally 10uF, 47uF, and 100uF in electrolytic and tantalum varieties. Always verify the external diameter of the through hole cap, it varies with capacity, voltage, and manufacturer. The EIA devices should be standard.
D2 D9 = diode:MBRS130LT3: Schottky Power Rectifier Source: http://www.onsemi.com/pub/Collateral/MBRS130LT3-D.PDF
D3 = diode:ZENER-DIODE: Z-Diode
D4-D8 = led:LED: LED OSRAM: - CHIPLED LG R971, LG N971, LY N971, LG Q971, LY Q971, LO R971, LY R971 LH N974, LH R974 LS Q976, LO Q976, LY Q976 LO Q996 - Hyper CHIPLED LW Q18S LB Q993, LB Q99A, LB R99A - SideLED LS A670, LO A670, LY A670, LG A670, LP A670 LB A673, LV A673, LT A673, LW A673 LH A674 LY A675 LS A676, LA A676, LO A676, LY A676, LW A676 LS A679, LY A679, LG A679 - Hyper Micro SIDELED® LS Y876, LA Y876, LO Y876, LY Y876 LT Y87S - SmartLED LW L88C, LW L88S LB L89C, LB L89S, LG L890 LS L89K, LO L89K, LY L89K LS L896, LA L896, LO L896, LY L896 - TOPLED LS T670, LO T670, LY T670, LG T670, LP T670 LSG T670, LSP T670, LSY T670, LOP T670, LYG T670 LG T671, LOG T671, LSG T671 LB T673, LV T673, LT T673, LW T673 LH T674 LS T676, LA T676, LO T676, LY T676, LB T676, LH T676, LSB T676, LW T676 LB T67C, LV T67C, LT T67C, LS T67K, LO T67K, LY T67K, LW E67C LS E67B, LA E67B, LO E67B, LY E67B, LB E67C, LV E67C, LT E67C LW T67C LS T679, LY T679, LG T679 LS T770, LO T770, LY T770, LG T770, LP T770 LB T773, LV T773, LT T773, LW T773 LH T774 LS E675, LA E675, LY E675, LS T675 LS T776, LA T776, LO T776, LY T776, LB T776 LHGB T686 LT T68C, LB T68C - Hyper Mini TOPLED® LB M676 - Mini TOPLED Santana® LG M470 LS M47K, LO M47K, LY M47K Source: http://www.osram.convergy.de LUXEON: - LUMILED® LXK2-PW12-R00, LXK2-PW12-S00, LXK2-PW14-U00, LXK2-PW14-V00 LXK2-PM12-R00, LXK2-PM12-S00, LXK2-PM14-U00 LXK2-PE12-Q00, LXK2-PE12-R00, LXK2-PE12-S00, LXK2-PE14-T00, LXK2-PE14-U00 LXK2-PB12-K00, LXK2-PB12-L00, LXK2-PB12-M00, LXK2-PB14-N00, LXK2-PB14-P00, LXK2-PB14-Q00 LXK2-PR12-L00, LXK2-PR12-M00, LXK2-PR14-Q00, LXK2-PR14-R00 LXK2-PD12-Q00, LXK2-PD12-R00, LXK2-PD12-S00 LXK2-PH12-R00, LXK2-PH12-S00 LXK2-PL12-P00, LXK2-PL12-Q00, LXK2-PL12-R00 Source: www.luxeon.com KINGBRIGHT: KA-3528ASYC Source: www.kingbright.com
IC1 = 1wire:DS18S20: High Precision Digital Thermometer This chip provides a onewire thermosensor with approx. 0.5°C accuracy.A programmable over/undertemperure alarm is available. Notes: Vdd must be applied for accurate measurements at low temperatures, as the parasite power circuit otherwise heats the sensor. If parasite power is used, Vdd has to be connected to GND. The DS1822 is a low-cost thermometer chip, the DS18B20 is similar to the DS18S20, but with 9..12 Bit programmable precision. Author: Jan Kandziora <jjj@gmx.de>
IC2 = v-reg-3:LM1117
IC2-ALT = cpv2:MMA7361L: The MMA7361LC is a low power, low profile capacitive micromachined accelerometer featuring signal conditioning, a 1-pole low pass filter, temperature compensation, self test, 0g-Detect which detects linear freefall, and g-Select which allows for the selection between 2 sensitivities. Zero-g offset and sensitivity are factory set and require no external devices. The MMA7361LC includes a Sleep Mode that makes it ideal for handheld battery powered electronics. http://www.freescale.com/webapp/sps/site/prod_summary.jsp?code=MMA7361L
IC3 = cpv2:LM372*: LM3722, LM3724 5-pin microprocessor reset circuits. LM3722: active low, push-pull LM3724: active low, open drain
IC4 = nxp:LPC2148
IC5 = ftdichip:FT232R: Source: http://www.ftdichip.com/Documents/DataSheets/DS_FT232R_v104.pdf
IC7 = maxim:MAX1551: Dual-Input USB/AC Adapter 1-Cell Li+ Battery Chargers Source: http://www.maxim-ic.com .. MAX1551-MAX1555.pdf
JP1-JP3 = jumper:JP1E: JUMPER
JP4 JP5 = jumper:JP2E: JUMPER
JP6-JP16 = jumper:SJ: SMD solder JUMPER
K1 = farnell:SDBMF: SD MEMORY CARD PUSH-PUSH WITH CONNECTOR TYPE B (BIG SWUÌTCH #3) KINGFONT PRECISION INDUSTIAL CO., LTD Source: http://www.farnell.com/datasheets/74273.pdf Best.-Nr.: 9186174 Hersteller: MULTICOMP Herstellerbez.: SDBMF-00915B0T2
K3 = con-cypressindustries:MINI-USB-SCHIELD-: MINI USB-B Conector Source: www.cypressindustries.com
K4 = con-molex:22-?-02: CONNECTOR wire to board 2.54 mm (.1 inch) pitch header
K5 = con-coax:SMA-: SMA 50 Ohm End Launch Jack Receptacle - Round Contact Johnson Components Source: www.johnsoncomponents.com .. J502-ND.pdf
K6 = con-lstb:MA04-1: PIN HEADER
K7 = con-lstb:MA09-1: PIN HEADER
K8-K10 = cpv2:MA14-1: PIN HEADER
L2 = resistor:L-US: INDUCTOR, American symbol
R1 R2 R5-R40 = resistor:R-US_: RESISTOR, American symbol
S1 = switch:255SB: SLIDING SWITCH Distributor Buerklin, 11G810
S2 = switch-omron:10-XX: OMRON SWITCH
T1-T3 T5 = zetex:PMOSSOT23: MOS FET
T4 = zetex:NMOSSOT23: MOS FET
TP1-TP4 = testpad:TPSQ: Test pad
U$1-U$3 = SparkFun:FIDUCIAL: Fiducial Alignment Points Various fiducial points for machine vision alignment.
X1 X2 = cpv2:CRYSTAL: CRYSTAL
Y1 = cpv2:BTM-11*: BTM-112 Bluetooth class 2 BC04-ext module
Y2 = cpv2:BTM-22*: BTM-22x Rayson class 1 BC04-ext Bluetooth module.

## Net classes
1 +5V: width 1.016 mm, drill 0.61 mm, clearance 0.61 mm
2 +3V3: width 0.762 mm, drill 0.508 mm